# EasyEDA Pro project ProPrj_Inverted_MAML_6x6_2026-07-06(1).epro, schematic MUL_NO_H_CELL_2X_2T1C
Create Date: 2026-06-07; Page Name: P1; Project Name: Inverted_MAML_6x6; Schematic Name: Schematic2; Update Date: 2026-06-07; Company: EasyEDA.com; Drawn: Olle Welin; Page Size: A4; Version: V1.0
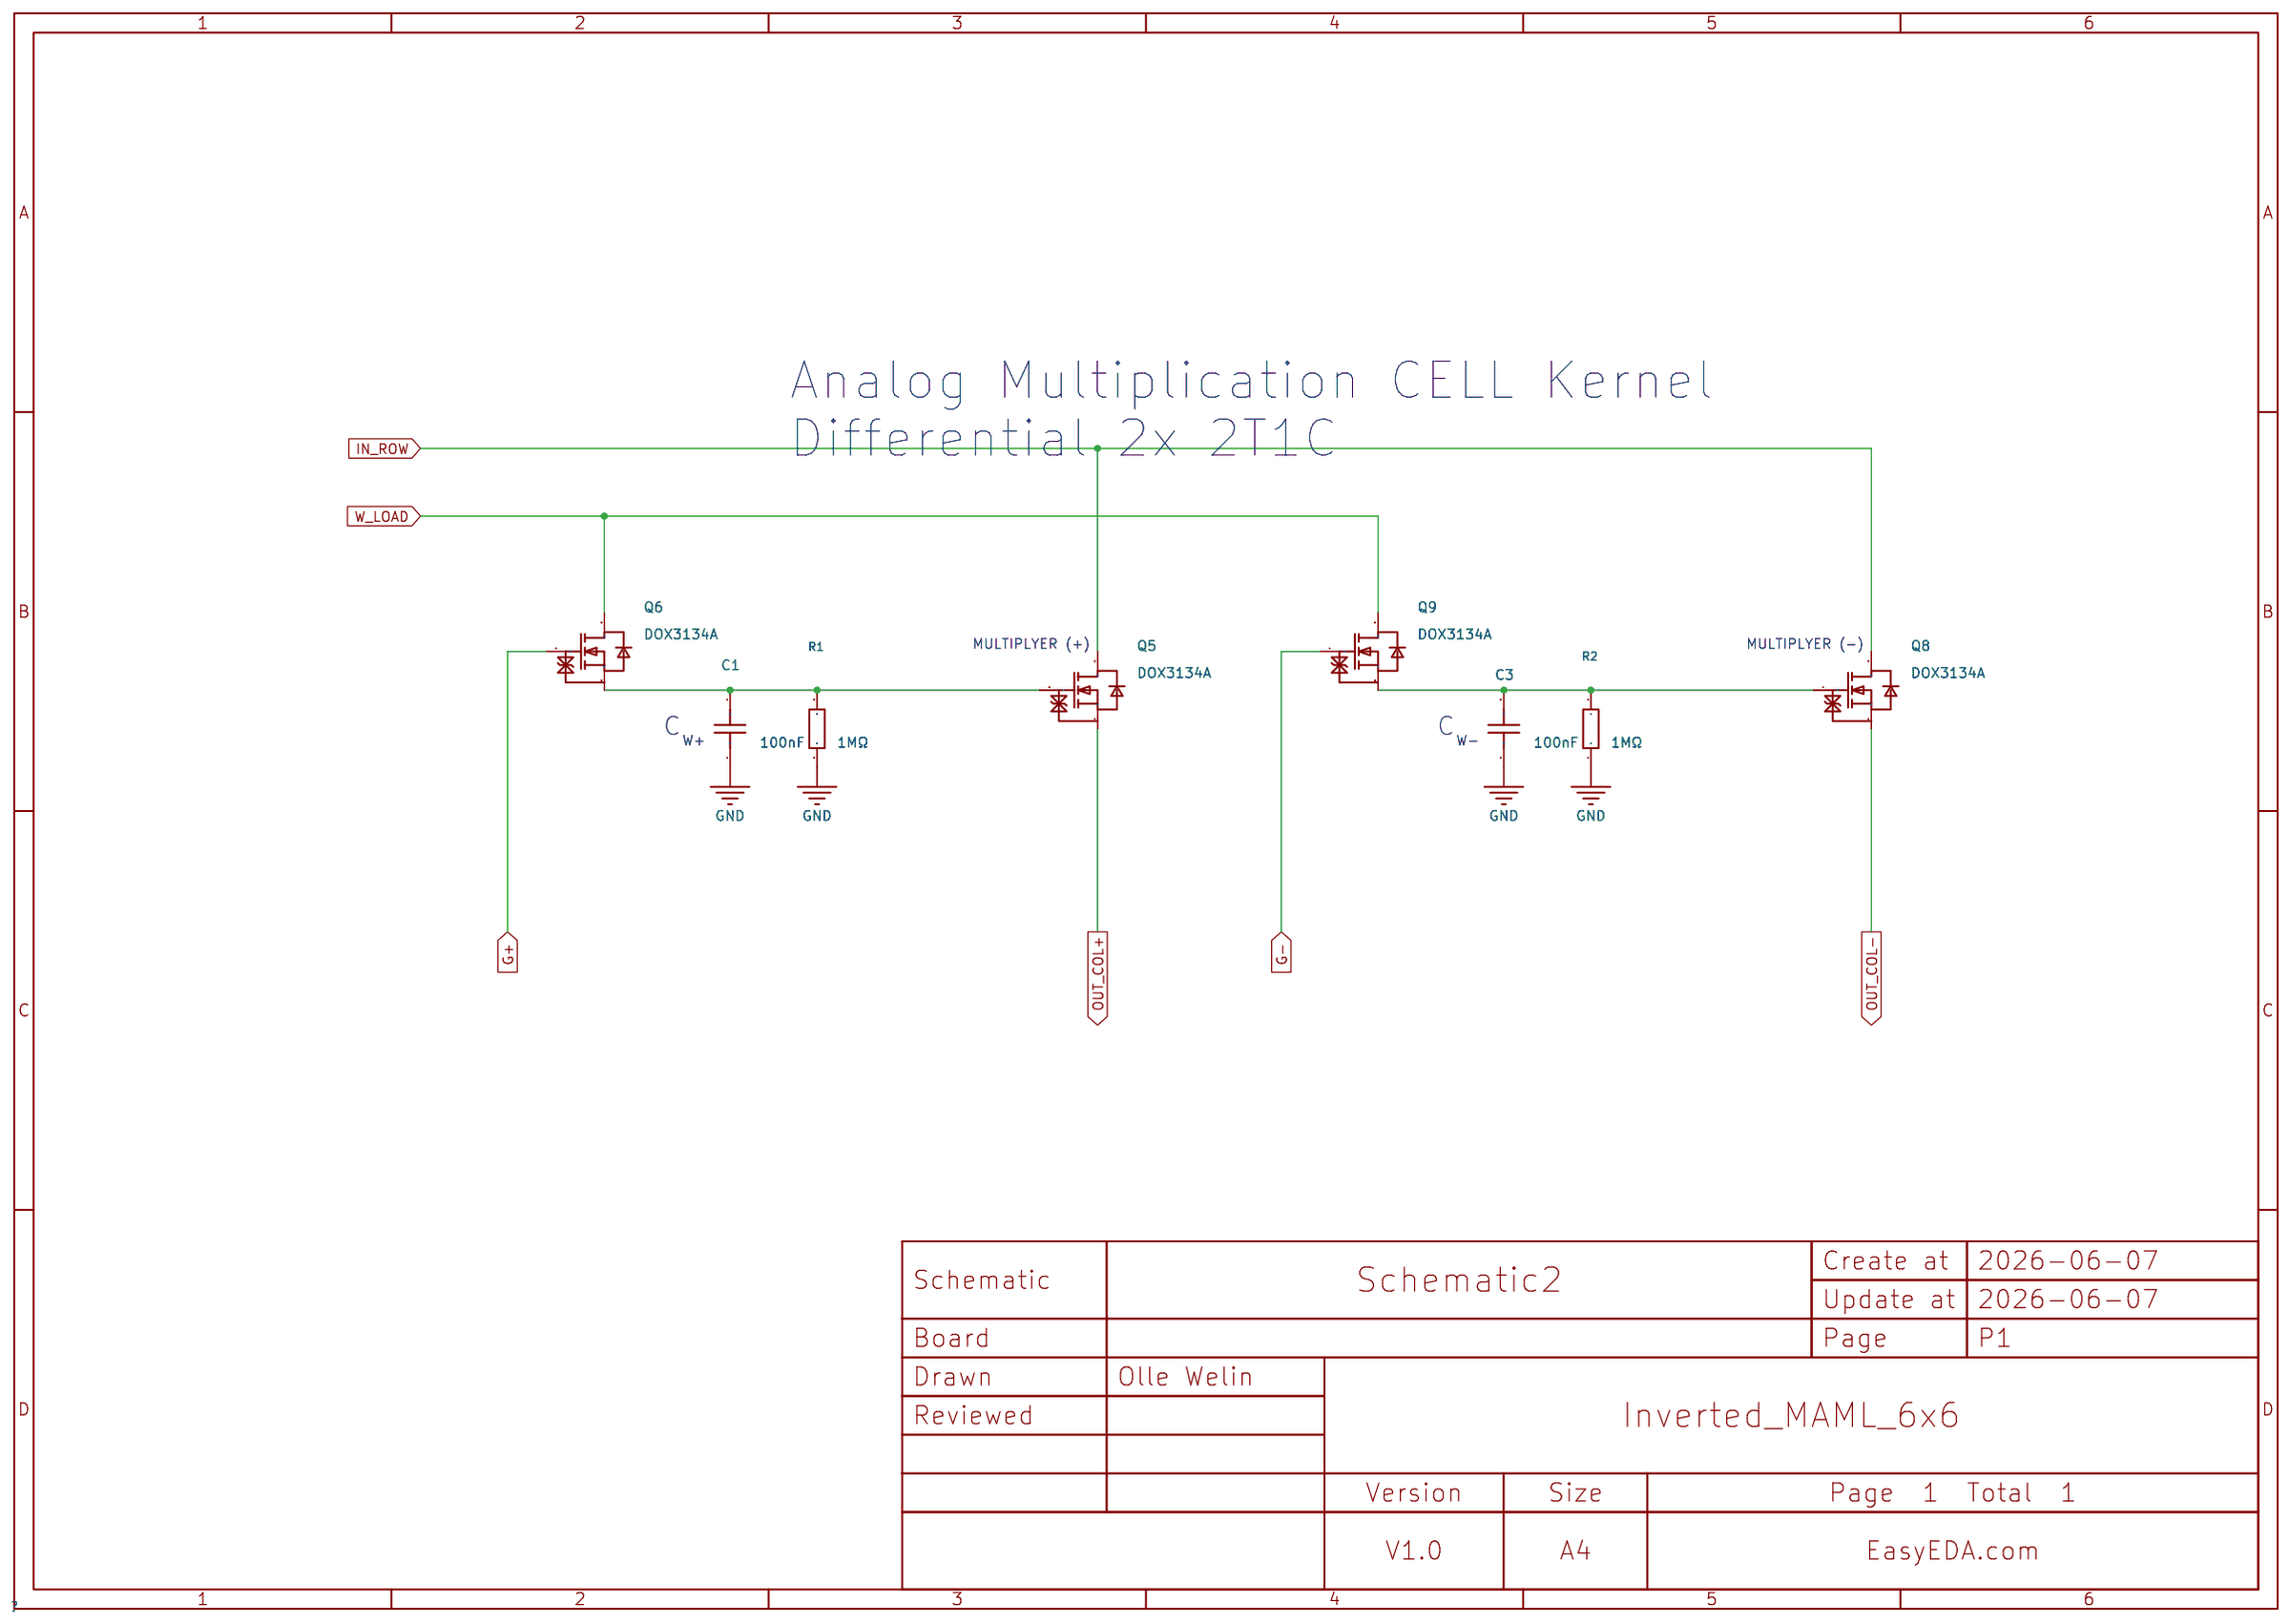
[diagram p4: schematic sheet]

## Parts
C1  100nF  [C0402]
C3  100nF  [C0402]
Q5  DOX3134A  [SOT-323-3_L2.1-W1.3-P1.30-LS2.3-BR]
Q6  DOX3134A  [SOT-323-3_L2.1-W1.3-P1.30-LS2.3-BR]
Q8  DOX3134A  [SOT-323-3_L2.1-W1.3-P1.30-LS2.3-BR]
Q9  DOX3134A  [SOT-323-3_L2.1-W1.3-P1.30-LS2.3-BR]
R1  1MΩ  [R0402]
R2  1MΩ  [R0402]

## Library data of the parts
C1 C3 = CL05B104KO5NNNC: Capacitance:100nF Tolerance:±10% Tolerance:±10% Voltage Rating:16V Temperature Coefficient:X7R; LCSC Part Name: 100nF ±10% 16V; Supplier Part: C1525; Manufacturer: SAMSUNG(三星); Supplier Footprint: 0402; JLCPCB Part Class: Basic Part; Datasheet: https://item.szlcsc.com/datasheet/CL05B104KO5NNNC/1877.html; Supplier: LCSC; Tolerance: ±10%; Voltage Rating: 16V; Temperature Coefficient: X7R
Q5 Q6 Q8 Q9 = DOX3134A: Number:1 N-channel Drain to Source Voltage:20V Current - Continuous Drain(Id):900mA RDS(on):120Ω@4.5V Pd - Power Dissipation:220mW Gate Threshold Voltage (Vgs(th)):600mV Gate Charge(Qg):1nC@4.5V Input Capacitance(Ciss):63pF Reverse Transfer Capacitance (C; Supplier Part: C54349756; Manufacturer: DOINGTER(杜因特); Supplier Footprint: SOT-323; JLCPCB Part Class: Extended Part; Datasheet: https://item.szlcsc.com/datasheet/DOX3134A/57652932.html; Supplier: LCSC; Number: 1 N-channel; Drain to Source Voltage: 20V; Current - Continuous Drain(Id): 900mA; RDS(on): 120Ω@4.5V; Pd - Power Dissipation: 220mW; Gate Threshold Voltage (Vgs(th)): 600mV; Gate Charge(Qg): 1nC@4.5V; Input Capacitance(Ciss): 63pF; Reverse Transfer Capacitance (Crss@Vds): 12pF; Operating Temperature: -50℃~+150℃; Type: N-Channel; Output Capacitance(Coss): 23pF
R1 R2 = 0402WGF1004TCE: Type:Thick Film Resistor Resistance:1MΩ Tolerance:±1% Tolerance:±1% Power(Watts):62.5mW Voltage-Supply(Max):50V Temperature Coefficient:±100ppm/℃ Temperature Coefficient:±100ppm/℃ Operating Temperature:-55℃~+155℃ Operating Temperature:-55℃~+155℃; LCSC Part Name: 1MΩ ±1% 62.5mW 厚膜电阻; Supplier Part: C26083; Manufacturer: UNI-ROYAL(厚声); Supplier Footprint: 0402; JLCPCB Part Class: Basic Part; Datasheet: https://item.szlcsc.com/datasheet/0402WGF1004TCE/26826.html; Supplier: LCSC; Type: Thick Film Resistor; Tolerance: ±1%; Power(Watts): 62.5mW; Voltage-Supply(Max): 50V; Temperature Coefficient: ±100ppm/℃; Operating Temperature: -55℃~+155℃

## Nets
GND: C1.1 C3.1 R1.1 R2.1
G+: Q6.1(G)
G-: Q9.1(G)
IN_ROW: Q5.3(D) Q8.3(D)
OUT_COL+: Q5.2(S)
OUT_COL-: Q8.2(S)
W_LOAD: Q6.3(D) Q9.3(D)
Net-(C1-2): C1.2 Q5.1(G) Q6.2(S) R1.2
Net-(C3-2): C3.2 Q8.1(G) Q9.2(S) R2.2

## Notes on the sheet
- Analog Multiplication CELL Kernel
  Differential 2x 2T1C
- MULTIPLYER (+)
- MULTIPLYER (-)
- C
- W+
- C
- W-
